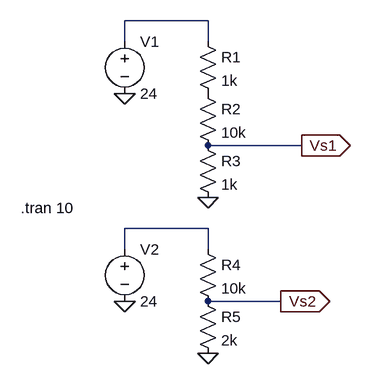
[diagram p0: schematic tension_divider.asc]
tension_divider.asc, the LTspice schematic file:
Version 4
SHEET 1 880 680
WIRE 112 64 -16 64
WIRE -16 96 -16 64
WIRE 112 96 112 64
WIRE 256 256 112 256
WIRE 112 384 -16 384
WIRE -16 416 -16 384
WIRE 112 416 112 384
WIRE 224 496 112 496
FLAG -16 176 0
FLAG 256 256 Vs1
IOPIN 256 256 Out
FLAG 112 336 0
FLAG -16 496 0
FLAG 224 496 Vs2
IOPIN 224 496 Out
FLAG 112 576 0
SYMBOL res 96 80 R0
SYMATTR InstName R1
SYMATTR Value 1k
SYMBOL res 96 160 R0
SYMATTR InstName R2
SYMATTR Value 10k
SYMBOL voltage -16 80 R0
WINDOW 123 0 0 Left 0
WINDOW 39 0 0 Left 0
SYMATTR InstName V1
SYMATTR Value 24
SYMBOL res 96 240 R0
SYMATTR InstName R3
SYMATTR Value 1k
SYMBOL res 96 400 R0
SYMATTR InstName R4
SYMATTR Value 10k
SYMBOL res 96 480 R0
SYMATTR InstName R5
SYMATTR Value 2k
SYMBOL voltage -16 400 R0
WINDOW 123 0 0 Left 0
WINDOW 39 0 0 Left 0
SYMATTR InstName V2
SYMATTR Value 24
TEXT -176 352 Left 2 !.tran 10

The netlist it stands for:
* tension_divider.asc
R1 N001 P001 1k
R2 P001 Vs1 10k
V1 N001 0 24
R3 Vs1 0 1k
R4 N002 Vs2 10k
R5 Vs2 0 2k
V2 N002 0 24
.tran 10
.backanno
.end

* Results of the author's LTspice run, read from the files saved beside the schematic
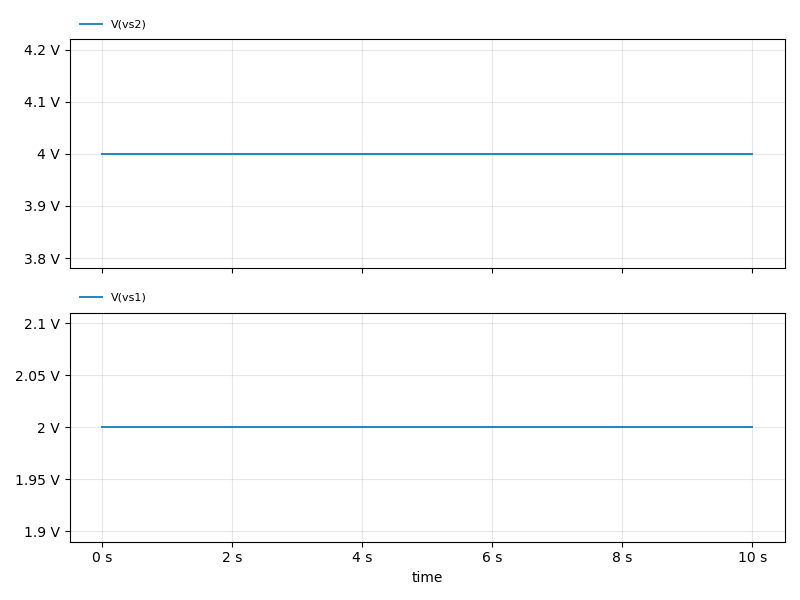
[diagram p1: Transient Analysis of tension_divider.asc, plotted from the saved traces]
* Transient Analysis, 1 run:
*   V(vs2): min 4 V, max 4 V, average 4 V, rms 4 V, last 4 V
*   V(vs1): min 2 V, max 2 V, average 2 V, rms 2 V, last 2 V